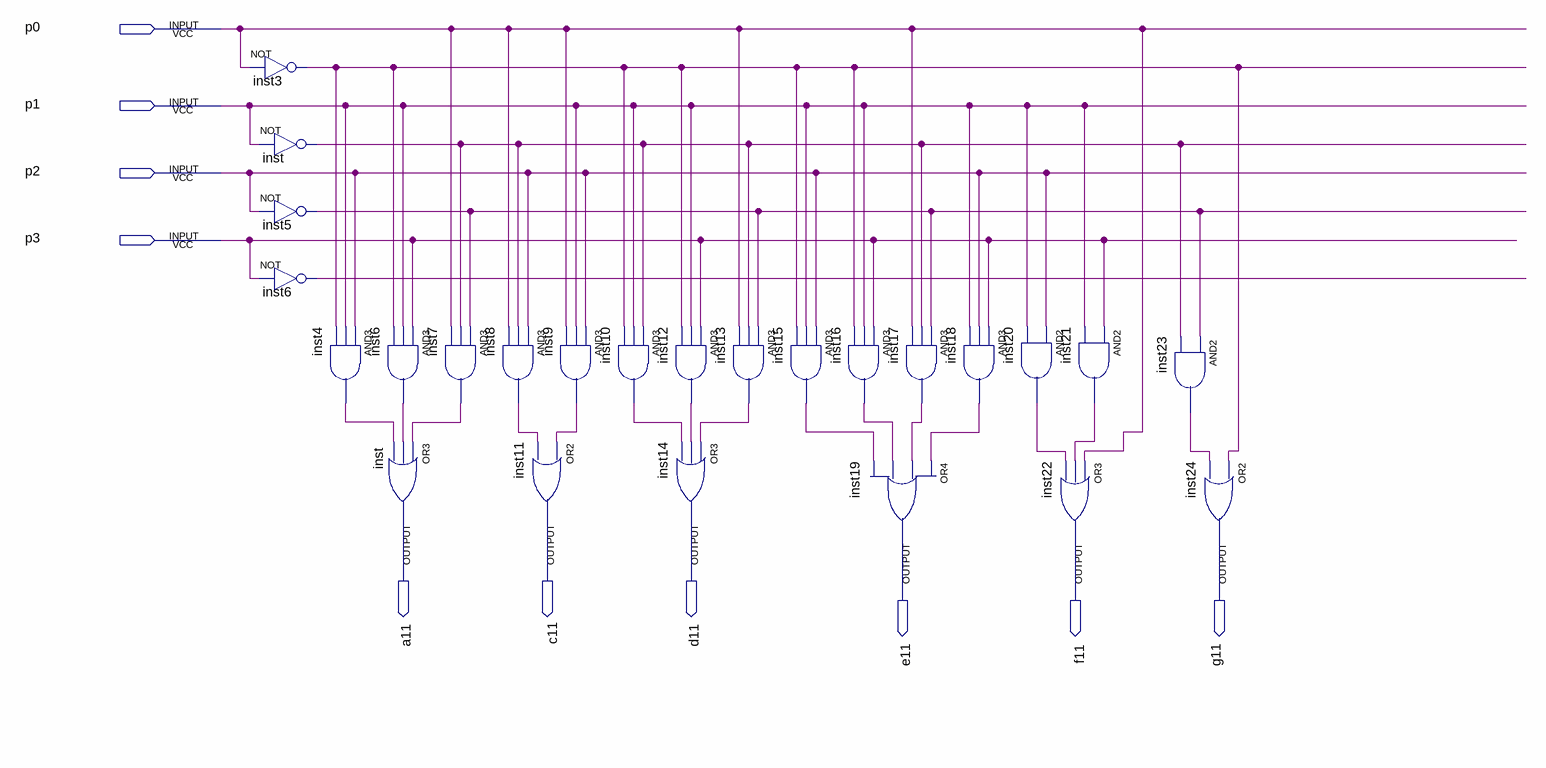
[diagram p0: schematic sheet]
// Quartus schematic decoder30.bdf as structural Verilog: 25 symbols, 10 pins
module decoder30 (
  input  p0,
  input  p1,
  input  p2,
  input  p3,
  output a11,
  output c11,
  output d11,
  output e11,
  output f11,
  output g11
);

  wire inst3_out, inst4_out, inst5_out, inst6_out, inst6_out_2, inst7_out, inst8_out, inst9_out, inst10_out,
       inst12_out, inst13_out, inst15_out, inst16_out, inst17_out, inst18_out, inst20_out, inst21_out,
       inst23_out, inst_out;

  not inst3 (inst3_out, p0);
  not inst (inst_out, p1);
  not inst5 (inst5_out, p2);
  not inst6 (inst6_out, p3);
  and inst4 (inst4_out, p2, p1, inst3_out);
  and inst6_dup2 (inst6_out_2, p3, p1, inst3_out);
  or inst_dup2 (a11, inst7_out, inst6_out_2, inst4_out);
  and inst7 (inst7_out, inst5_out, inst_out, p0);
  and inst9 (inst9_out, p2, p1, p0);
  and inst8 (inst8_out, p2, inst_out, p0);
  or inst11 (c11, inst9_out, inst8_out);
  and inst10 (inst10_out, inst_out, p1, inst3_out);
  and inst12 (inst12_out, p3, p1, inst3_out);
  or inst14 (d11, inst13_out, inst12_out, inst10_out);
  and inst13 (inst13_out, inst5_out, inst_out, p0);
  and inst15 (inst15_out, p2, p1, inst3_out);
  and inst16 (inst16_out, p3, p1, inst3_out);
  or inst19 (e11, inst18_out, inst17_out, inst16_out, inst15_out);
  and inst17 (inst17_out, inst5_out, inst_out, p0);
  and inst18 (inst18_out, p3, p2, p1);
  and inst20 (inst20_out, p2, p1);
  and inst21 (inst21_out, p3, p1);
  or inst22 (f11, p0, inst21_out, inst20_out);
  and inst23 (inst23_out, inst5_out, inst_out);
  or inst24 (g11, inst3_out, inst23_out);
endmodule
